# EasyEDA Pro project 25工创PCB.eprj, schematic 功率板原理图
Board Name: Board1; Create Date: 2024-12-11; Page Name: P1; Project Name: 25工创PCB; Schematic Name: power; Update Date: 2024-12-11; Company: 嘉立创EDA; Page Size: A4; Version: V1.0
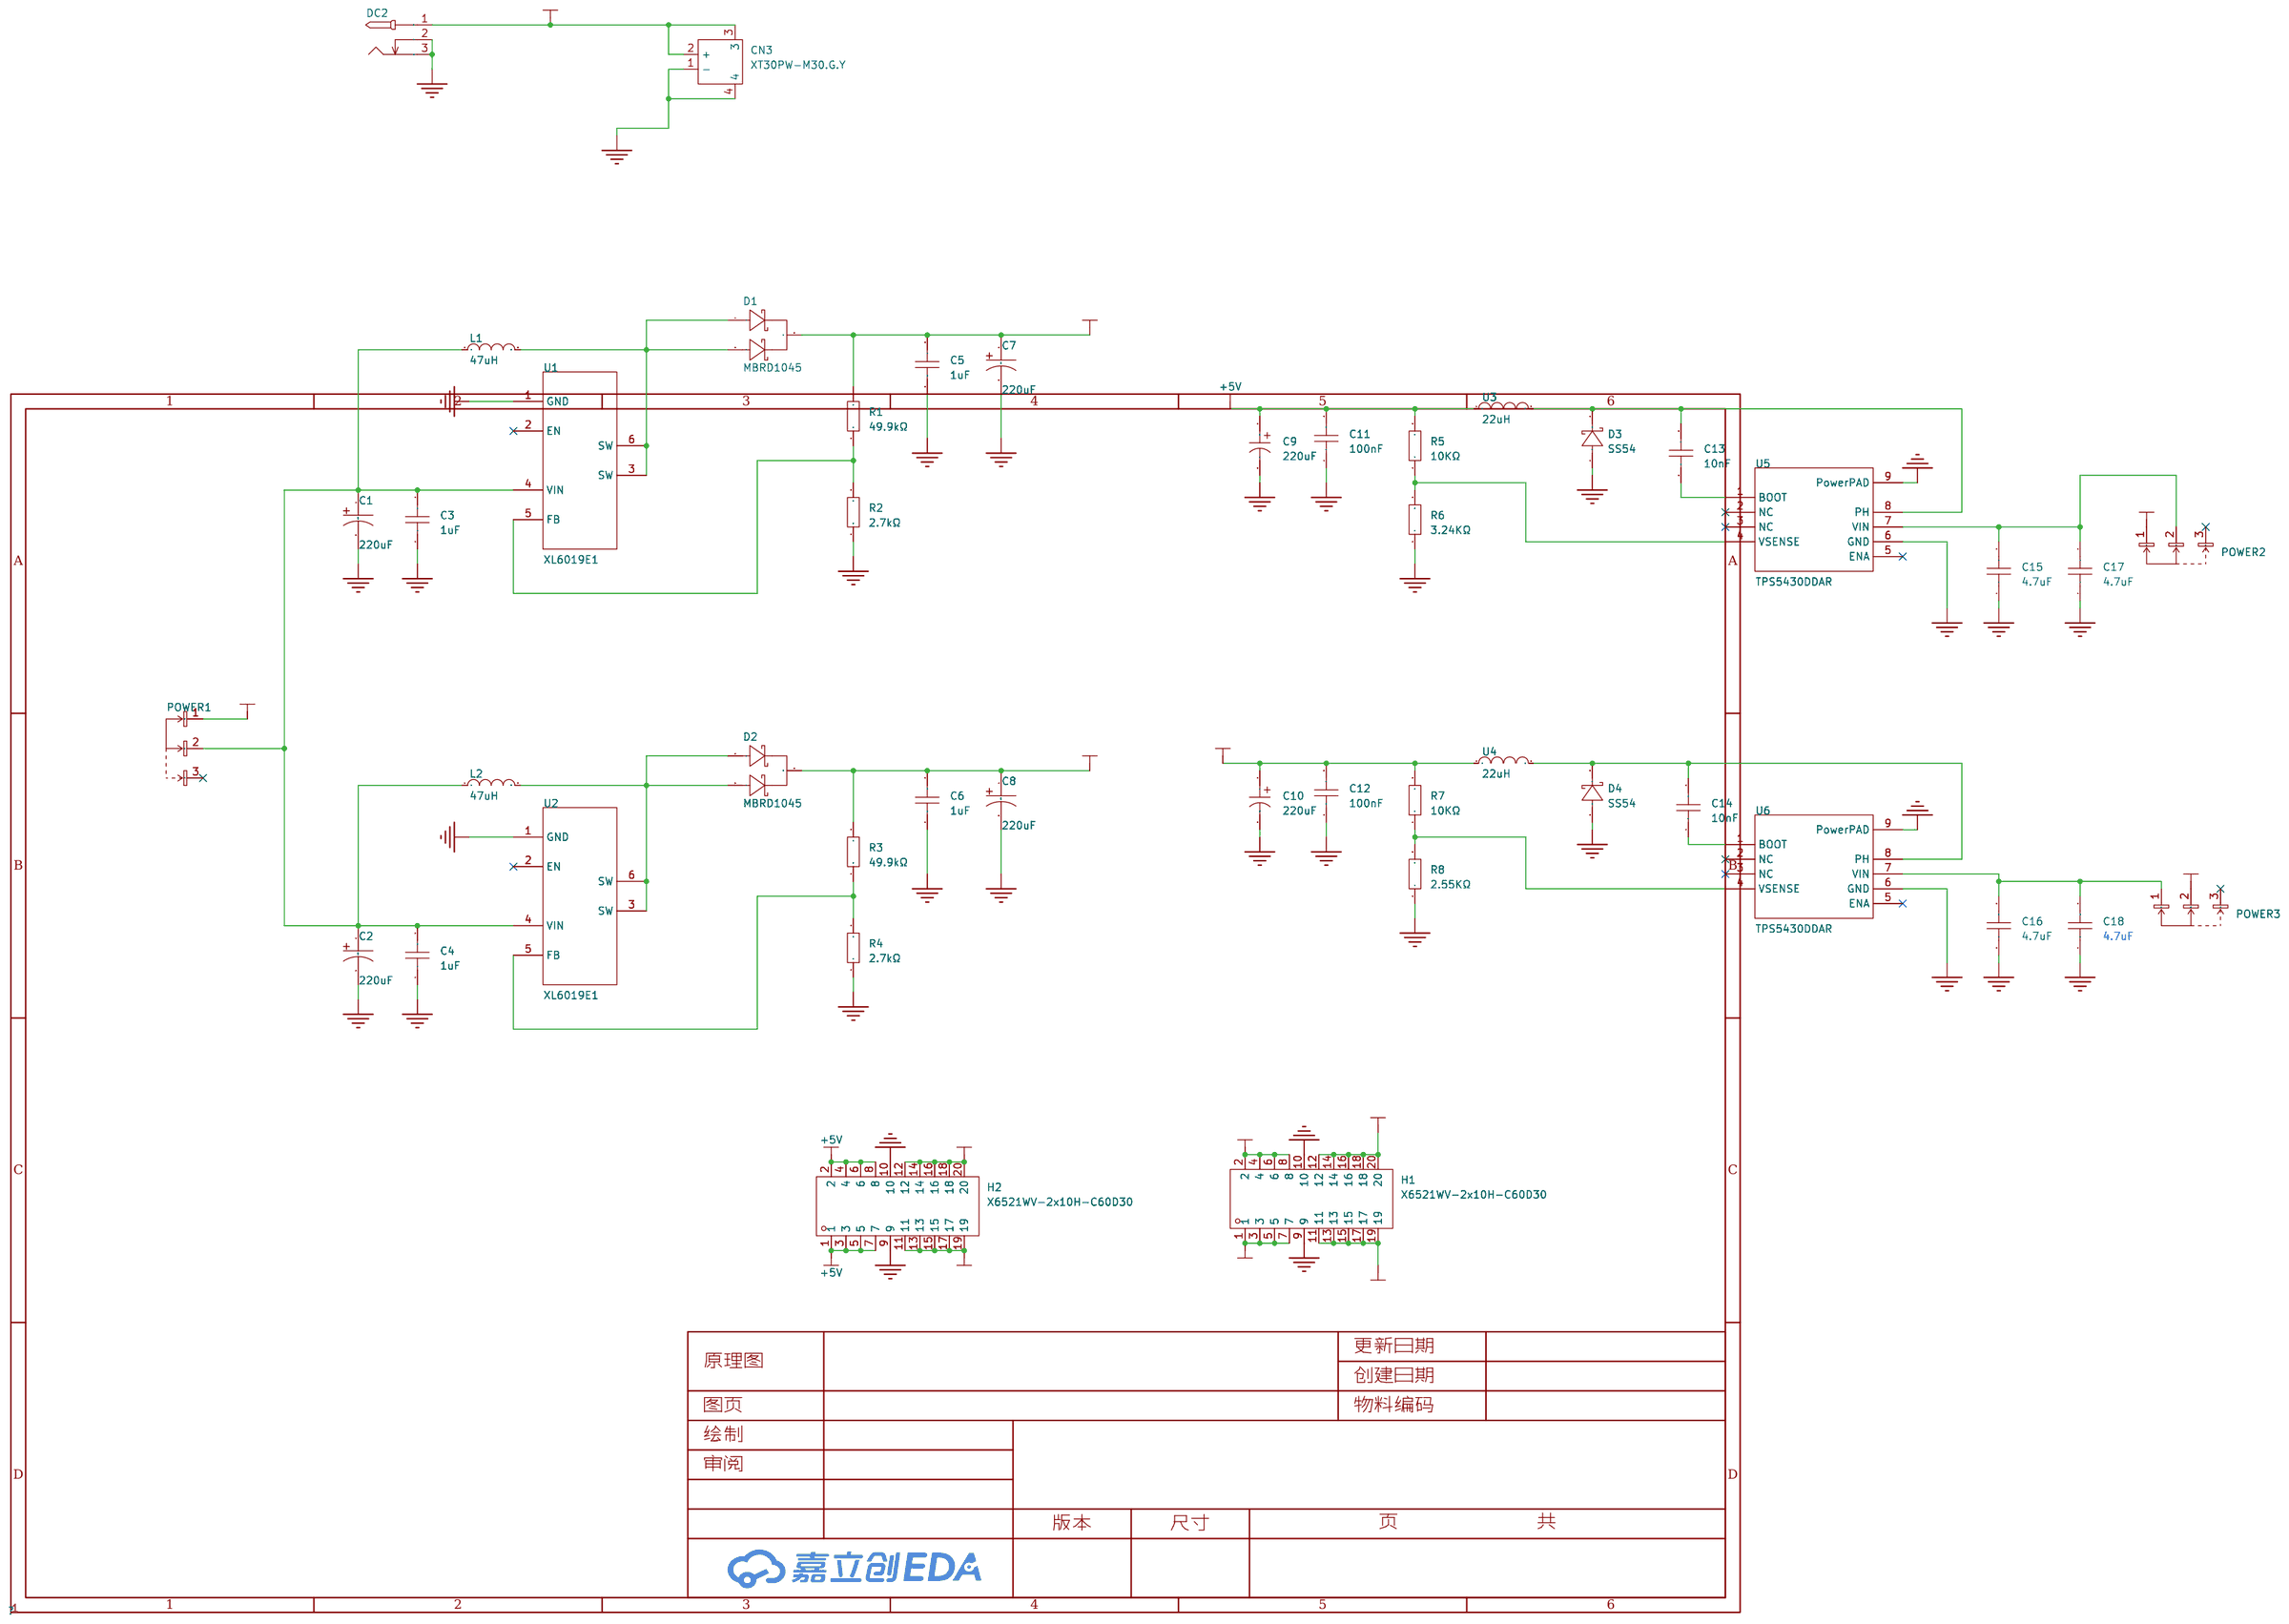
[diagram p0: schematic sheet]

## Parts
C1  680uF  [CAP-SMD_BD10.0-L10.3-W10.3-LS11.3-FD]
C2  680uF  [CAP-SMD_BD10.0-L10.3-W10.3-LS11.3-FD]
C3  1uF  [C0603]
C4  1uF  [C0603]
C5  1uF  [C0603]
C6  1uF  [C0603]
C7  680uF  [CAP-SMD_BD10.0-L10.3-W10.3-LS11.3-FD]
C8  680uF  [CAP-SMD_BD10.0-L10.3-W10.3-LS11.3-FD]
C9  220uF  [CAP-SMD_BD6.3-L6.6-W6.6-FD]
C10  220uF  [CAP-SMD_BD6.3-L6.6-W6.6-FD]
C11  100nF  [C0603]
C12  100nF  [C0603]
C13  10nF  [C0603]
C14  10nF  [C0603]
C15  4.7uF  [C0603]
C16  4.7uF  [C0603]
C17  4.7uF  [C0603]
C18  4.7uF  [C0603]
CN3  XT30PW-M30.G.Y  [CONN-TH_XT30PW-M]
D1  MBRD1045  [TO-252-3_L6.5-W5.9-P4.60-LS10.0-BL]
D2  MBRD1045  [TO-252-3_L6.5-W5.9-P4.60-LS10.0-BL]
D3  SS54  [SMA_L4.3-W2.6-LS5.0-FD]
D4  SS54  [SMA_L4.3-W2.6-LS5.0-FD]
DC2  -  [DC-IN-TH_DC005]
H1  X6521WV-2x10H-C60D30  [HDR-TH_20P-P2.54-V-M-R2-C10-S2.54]
H2  X6521WV-2x10H-C60D30  [HDR-TH_20P-P2.54-V-M-R2-C10-S2.54]
L1  47uH  [IND-SMD_L7.0-W6.6_FXL0630]
L2  47uH  [IND-SMD_L7.0-W6.6_FXL0630]
POWER1  SS-12D06L5  [SW-TH_3P-P4.70_L11.1-W12.7]
POWER2  SS-12D06L5  [SW-TH_3P-P4.70_L11.1-W12.7]
POWER3  SS-12D06L5  [SW-TH_3P-P4.70_L11.1-W12.7]
R1  49.9kΩ  [R0603]
R2  2.7kΩ  [R0603]
R3  49.9kΩ  [R0603]
R4  2.7kΩ  [R0603]
R5  10KΩ  [R0603]
R6  3.24KΩ  [R0603]
R7  10KΩ  [R0603]
R8  2.55KΩ  [R0603]
U1  XL6019E1  [TO-263-5_L10.2-W9.9-P1.70-LS14.4-TL]
U2  XL6019E1  [TO-263-5_L10.2-W9.9-P1.70-LS14.4-TL]
U3  22uH  [IND-SMD_L7.2-W6.6_GPSR07X0]
U4  22uH  [IND-SMD_L7.2-W6.6_GPSR07X0]
U5  TPS5430DDAR  [ESOP-8_L4.9-W3.9-P1.27-LS6.0-TL-EP]
U6  TPS5430DDAR  [ESOP-8_L4.9-W3.9-P1.27-LS6.0-TL-EP]

## Library data of the parts
C1 C2 C7 C8 = RVT1C681M1010: 容值:680uF;精度:±20%;额定电压:16V;纹波电流:-;等效串联电阻:-;; LCSC Part Name: 680uF ±20% 16V; Supplier Part: C335987; Manufacturer: ROQANG(容强); Supplier Footprint: SMD,D10xL10.2mm; JLCPCB Part Class: Extended Part; Datasheet: https://atta.szlcsc.com/upload/public/pdf/source/20181128/C335987_23CA7AA50FB42690DF736C43FE112376.pdf; Supplier: LCSC; Tolerance: ±20%; Rated Voltage: 16V; φD: 10mm; L: 10.2mm; Lifetime @ Temp: 2000hrs@105; Operating Temperature: -45~+105
C3-C6 = CL10A105KB8NNNC: 容值:1uF;精度:±10%;额定电压:50V;材质(温度系数):X5R;; LCSC Part Name: 1uF ±10% 50V; Supplier Part: C15849; Manufacturer: SAMSUNG(三星); Supplier Footprint: 0603; JLCPCB Part Class: 基础库; Datasheet: https://atta.szlcsc.com/upload/public/pdf/source/20160218/1457707763339.pdf; Supplier: LCSC; Tolerance: ±10%; Voltage Rated: 50V; Temperature Coefficient: X5R
C9 C10 = RVT220UF16V67RV0015: 容值:220uF;精度:±20%;额定电压:16V;纹波电流:110mA@120Hz;等效串联电阻:-;; LCSC Part Name: 220uF ±20% 16V; Supplier Part: C2887273; Manufacturer: KNSCHA(科尼盛); Supplier Footprint: SMD,D6.3xL7.7mm; JLCPCB Part Class: 扩展库; Datasheet: https://atta.szlcsc.com/upload/public/pdf/source/20210824/3DC9999D9B098FE241E3A26137981C4C.pdf; Supplier: LCSC; Tolerance: ±20%; Rated Voltage: 16V; Ripple Current: 110mA@120Hz; φD: 6.3mm; L: 7.7mm; Lifetime @ Temp: 2000hrs@105℃; Operating Temperature: -55℃~+105℃
C11-C18 = CAP_0603: Supplier Footprint: 0603
CN3 = XT30PW-M30.G.Y: LCSC Part Name: AMASS(艾迈斯)航模插头 卧式弯脚 XT30PW-M公头; Supplier Part: C431092; Manufacturer: AMASS(艾迈斯); JLCPCB Part Class: 扩展库; Datasheet: https://atta.szlcsc.com/upload/public/pdf/source/20220222/6A9F22F7850E25B33E1BE430ADF8560B.pdf; Supplier: LCSC; Type: 航模插头; RatedVoltage: DC 500V; InterfaceType: 公头; RatedCurrent: 15A; RecommendedWireGauge: 16/18/20AWG; contact resistance: 1.2mΩ; specifications: 2pin
D1 D2 = MBRD1045: 二极管配置:1对共阴极;正向压降(Vf):550mV@10A;直流反向耐压(Vr):45V;平均整流电流(Io):10A;; LCSC Part Name: 电压:45V 电流:10A; Supplier Part: C5137764; Manufacturer: GOODWORK(固得沃克); Supplier Footprint: TO-252; JLCPCB Part Class: 扩展库; Datasheet: https://atta.szlcsc.com/upload/public/pdf/source/20220811/0184EE9629AA1C466BA3600FC4FB457A.pdf; Supplier: LCSC; Diode Configuration: 1对共阴极; Forward Voltage (Vf@If): 550mV@10A; Reverse Voltage (Vr): 45V; Average Rectified Current (Io): 10A; Reverse Leakage Current (Ir): 100uA@45V
D3 D4 = SS54_C7420369: 二极管配置:独立式;正向压降(Vf):550mV@5.0A;直流反向耐压(Vr):40V;平均整流电流(Io):5A;; LCSC Part Name: 电压:40V 电流:5A; Supplier Part: C7420369; Manufacturer: 宏迦橙; Supplier Footprint: SMA(DO-214AC); JLCPCB Part Class: Extended Part; Datasheet: https://atta.szlcsc.com/upload/public/pdf/source/20230828/254C3882F8647358AD9F60DD73611B5E.pdf; Supplier: LCSC; Diode Configuration: 独立式; Forward Voltage (Vf@If): 550mV@5.0A; Reverse Voltage (Vr): 40V; Average Rectified Current (Io): 5A; Reverse Leakage Current (Ir): 50uA@40V; Peak forward surge current: 120A
DC2 = DC-005_2.5: 连接器类型:DC电源插座;触点内径:2.5mm;触点外径:6.4mm;额定电流:500mA;额定电压:30V;; Supplier Part: C136715; Supplier Footprint: 插件
H1 H2 = X6521WV-2x10H-C60D30: 插针结构:2x10P;间距:2.54mm;行距:2.54mm;圆针/方针:方针;安装类型:-;排数:双排;总PIN位数:20P;额定电流:3A;额定电压:250V;配合针长度:-;塑高:2.5mm;端接针长度:-;触头材质:黄铜;触头镀层:金;工作温度范围:-40℃~+105℃;焊接温度(最大值):260℃;颜色:黑色;; LCSC Part Name: 2x10P 间距:2.54mm 方针; Supplier Part: C706900; Manufacturer: XKB Connection(中国星坤); Supplier Footprint: 插件,P=2.54mm; JLCPCB Part Class: 扩展库; Datasheet: https://atta.szlcsc.com/upload/public/pdf/source/20240506/64134E73DB35DA9A421C824B04192394.pdf; Supplier: LCSC; Pin Structure: 2x10P; Pitch: 2.54mm; Row Spacing: 2.54mm; Circluar Pins/Square Pins: 方针; Number of Rows: 双排; Number of Pins: 20P; Current Rating (Max): 3A; Voltage Rating (Max): 250V; Insulation Height: 2.5mm; Contact Material: 黄铜; Contact Plating: 金; Operating Temperature Range: -40℃~+105℃; Soldering Temperature(Max): 260℃; Color: 黑色
L1 L2 = FXL0630-470-M: 电感值:47uH;精度:±20%;额定电流:1.5A;饱和电流(Isat):2A;类型:一体成型电感;; LCSC Part Name: 47uH ±20% 2A; Supplier Part: C475913; Manufacturer: cjiang(长江微电); Supplier Footprint: SMD,6.6x7mm; JLCPCB Part Class: 扩展库; Datasheet: https://atta.szlcsc.com/upload/public/pdf/source/20240426/3189EA8206330E2108542F9E34E540E7.pdf; Supplier: LCSC; Tolerance: ±20%; Rated Current: 1.5A; Saturation Current (Isat): 2A; DC Resistance (DCR): 385mΩ; Type: 一体成型电感
POWER1-POWER3 = SS-12D06L5: 额定电流(DC):3A;额定电压(DC):250V;额定电流(AC):3A;额定电压(AC):250V;电路结构:单刀双掷;安装方式:卧插;机械寿命:1万次;开关颜色:黑色;; LCSC Part Name: 柄长5mm 卧插双档 滑动开关; Supplier Part: C319015; Manufacturer: XKB Connectivity(中国星坤); Supplier Footprint: 插件; JLCPCB Part Class: Extended Part; Datasheet: https://atta.szlcsc.com/upload/public/pdf/source/20211009/0D67854FD60FB1F6FE75130AD47C052C.pdf; Supplier: LCSC; Current Rating (DC): 3A; Voltage Rating (DC): 250V; Current Rating (AC): 3A; Voltage Rating (AC): 250V; Circuit: 单刀双掷; Mounting Style: 卧插; Mechanical Life: 1万次; Actuator Color: 黑色; Actuator Style: 矩形柱状; Pin Style: PC引脚; Operating Temperature: -40~+85; Switch Length: 12.95mm; Switch Width: 6.6mm; Switch Height: 6.3mm
R1-R4 = 0603WAF4992T5E: 电阻类型:厚膜电阻;阻值:49.9kΩ;精度:±1%;功率:100mW;最大工作电压:75V;温度系数:±100ppm/℃;; LCSC Part Name: 49.9kΩ ±1% 100mW 厚膜电阻; Supplier Part: C23184; Manufacturer: UNI-ROYAL(厚声); Supplier Footprint: 0603; JLCPCB Part Class: Basic Part; Datasheet: https://atta.szlcsc.com/upload/public/pdf/source/20200306/C422600_1E6D84923E4A46A82E41ADD87F860B5C.pdf; Supplier: LCSC; Type: 厚膜电阻; Tolerance: ±1%; Power(Watts): 100mW; Overload Voltage (Max): 75V; Temperature Coefficient: ±100ppm/℃; Operating Temperature Range: -55℃~+155℃
R5-R8 = Res_0603: Supplier Footprint: 0603
U1 U2 = XL6019E1: 功能类型:升压型;输出类型:-;输入电压:5V~40V;输出电压:60V;输出电流(最大值):5A;; Supplier Part: C73018; Manufacturer: XLSEMI(芯龙); Supplier Footprint: TO-263-5; JLCPCB Part Class: 扩展库; Datasheet: https://atta.szlcsc.com/upload/public/pdf/source/20230915/0F37A40A07D65557F92F701F29EBE038.pdf; Supplier: LCSC; Function: 升压型; Input Voltage: 5V~40V; Output Voltage: 60V; Output Current (Max): 5A; Switching Frequency: 180kHz; Synchronous Rectification: 否; Number of Outputs: 1; Topology: 升压式; Switch tube (built-in/external): 内置
U3 U4 = CYA0650-22UH: 电感值:22uH;精度:±20%;额定电流:2.6A;直流电阻(DCR):110mΩ;; LCSC Part Name: 22uH ±20%; Supplier Part: C5189963; Manufacturer: SHOU HAN(首韩); Supplier Footprint: SMD,7.2x6.6mm; JLCPCB Part Class: 扩展库; Datasheet: https://atta.szlcsc.com/upload/public/pdf/source/20221010/25496B74ADB5AF85F6883FB06F6FDCEC.pdf; Supplier: LCSC; Tolerance: ±20%; Rated Current: 2.6A; DC Resistance (DCR): 110mΩ
U5 U6 = TPS5430DDAR: +5V; LCSC Part Name: 降压 3A 36V; Supplier Part: C9864; Manufacturer: TI(德州仪器); Supplier Footprint: SOIC-8-EP; JLCPCB Part Class: 基础库; Datasheet: https://www.ti.com/cn/lit/gpn/tps5430; Supplier: LCSC; Function: 降压型; Output Type: 可调; Input Voltage: +5V; Output Voltage: 1.221V~32.04V; Output Current (Max): 3A; Switching Frequency: 500kHz; Operating Temperature: -40℃~+125℃@(TJ); Synchronous Rectification: 否; Number of Outputs: 1; Topology: 降压式; Switch tube (built-in/external): 内置

## Nets
24V_1: C5.2 C7.1 D1.2(K) H2.11 H2.12 H2.13 H2.14 H2.15 H2.16 H2.17 H2.18 H2.19 H2.20 R1.2
24V_2: C6.2 C8.1 D2.2(K) H1.11 H1.12 H1.13 H1.14 H1.15 H1.16 H1.17 H1.18 H1.19 H1.20 R3.2
+5V: C9.1 C11.2 H2.1 H2.2 H2.3 H2.4 H2.5 H2.6 H2.7 H2.8 R5.2 U3.1
+6V: C10.1 C12.2 H1.1 H1.2 H1.3 H1.4 H1.5 H1.6 H1.7 H1.8 R7.2 U4.1
GND: C1.2 C2.2 C3.1 C4.1 C5.1 C6.1 C7.2 C8.2 C9.2 C10.2 C11.1 C12.1 C15.1 C16.1 C17.1 C18.1 CN3.1(-) CN3.4 D3.1(A) D4.1(A) DC2.2 DC2.3 H1.9 H1.10 H2.9 H2.10 R2.1 R4.1 R6.1 R8.1 U1.1(GND) U2.1(GND) U5.6(GND) U5.9(PowerPAD) U6.6(GND) U6.9(PowerPAD)
+POW: CN3.2(+) CN3.3 DC2.1 POWER1.1 POWER2.1 POWER3.2
$1N7163: D1.1(A) D1.3(A) L1.2 U1.3(SW) U1.6(SW)
$1N7164: R1.1 R2.2 U1.5(FB)
$1N7175: R3.1 R4.2 U2.5(FB)
$1N7176: D2.1(A) D2.3(A) L2.2 U2.3(SW) U2.6(SW)
$1N7193: R5.1 R6.2 U5.4(VSENSE)
$1N7196: C13.2 D3.2(K) U3.2 U5.8(PH)
$1N7197: C13.1 U5.1(BOOT)
$1N7209: C14.2 D4.2(K) U4.2 U6.8(PH)
$1N7211: R7.1 R8.2 U6.4(VSENSE)
$1N7216: C14.1 U6.1(BOOT)
$1N7218: C15.2 C17.2 POWER2.2 U5.7(VIN)
$1N8312: C1.1 C2.1 C3.2 C4.2 L1.1 L2.1 POWER1.2 U1.4(VIN) U2.4(VIN)
$1N8365: C16.2 C18.2 POWER3.1 U6.7(VIN)

Not connected (* = marked no-connect by the designer): POWER1 3*; POWER2 3*; POWER3 3*; U1 2(EN)*; U2 2(EN)*; U5 2(NC)* 3(NC)* 5(ENA)*; U6 2(NC)* 3(NC)* 5(ENA)*
